# Altium project BCD_TO_7SEG_MODULE.PrjPcb (part 2 of 2)
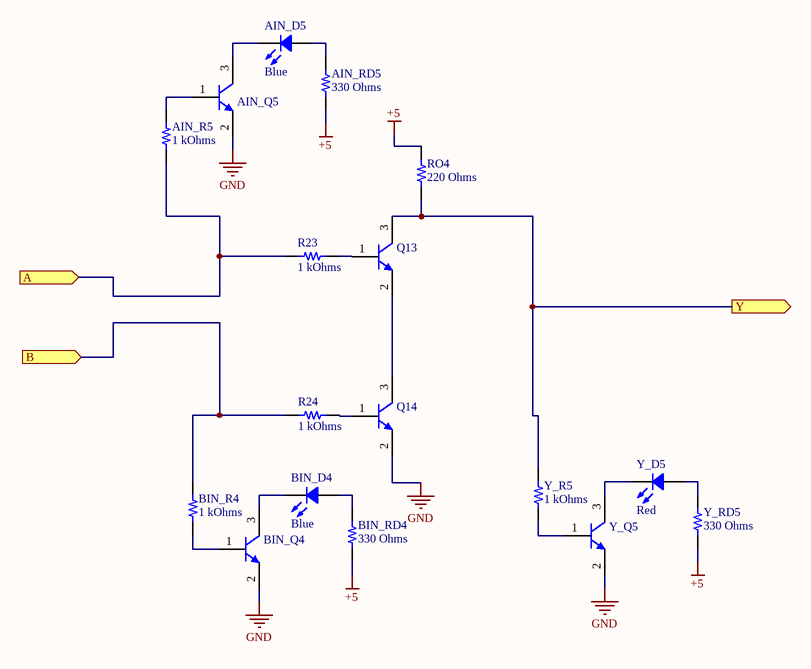
[diagram p6: NAND_GATE.SchDoc]

## Nets that join several sheets
+5: MODULE_1 (IN1.1 IN1.2 OUT1.1), U_XOR_GATE_00 (7 pins), U_NOT_GATE_01 (AIN_RD3_U_NOT_GATE_01.1 RO3_U_NOT_GATE_01.2 Y_RD3_U_NOT_GATE_01.1), U_OR_GATE_22 (5 pins), U_AND_GATE_42 (5 pins), U_NAND_GATE_10 (AIN_RD5_U_NAND_GATE_10.1 BIN_RD4_U_NAND_GATE_10.1 RO4_U_NAND_GATE_10.2 Y_RD5_U_NAND_GATE_10.1), U_XOR_GATE_20 (7 pins), U_XOR_GATE_21 (7 pins), U_OR_GATE_30 (5 pins), U_OR_GATE_31 (5 pins), U_OR_GATE_32 (5 pins), U_NAND_GATE_40 (AIN_RD5_U_NAND_GATE_40.1 BIN_RD4_U_NAND_GATE_40.1 RO4_U_NAND_GATE_40.2 Y_RD5_U_NAND_GATE_40.1), U_OR_GATE_41 (5 pins), U_AND_GATE_43 (5 pins), U_AND_GATE_44 (5 pins), U_AND_GATE_45 (5 pins), U_NOT_GATE_50 (AIN_RD3_U_NOT_GATE_50.1 RO3_U_NOT_GATE_50.2 Y_RD3_U_NOT_GATE_50.1), U_NOT_GATE_51 (AIN_RD3_U_NOT_GATE_51.1 RO3_U_NOT_GATE_51.2 Y_RD3_U_NOT_GATE_51.1), U_NOT_GATE_52 (AIN_RD3_U_NOT_GATE_52.1 RO3_U_NOT_GATE_52.2 Y_RD3_U_NOT_GATE_52.1), U_NOT_GATE_53 (AIN_RD3_U_NOT_GATE_53.1 RO3_U_NOT_GATE_53.2 Y_RD3_U_NOT_GATE_53.1), U_NOT_GATE_54 (AIN_RD3_U_NOT_GATE_54.1 RO3_U_NOT_GATE_54.2 Y_RD3_U_NOT_GATE_54.1), U_NOT_GATE_55 (AIN_RD3_U_NOT_GATE_55.1 RO3_U_NOT_GATE_55.2 Y_RD3_U_NOT_GATE_55.1), U_NOT_GATE_56 (AIN_RD3_U_NOT_GATE_56.1 RO3_U_NOT_GATE_56.2 Y_RD3_U_NOT_GATE_56.1)
GND: MODULE_1 (IN1.8 IN1.9 OUT1.9), U_XOR_GATE_00 (6 pins), U_NOT_GATE_01 (AIN_Q3_U_NOT_GATE_01.2 Q7_U_NOT_GATE_01.2 Y_Q3_U_NOT_GATE_01.2), U_OR_GATE_22 (6 pins), U_AND_GATE_42 (5 pins), U_NAND_GATE_10 (AIN_Q5_U_NAND_GATE_10.2 BIN_Q4_U_NAND_GATE_10.2 Q14_U_NAND_GATE_10.2 Y_Q5_U_NAND_GATE_10.2), U_XOR_GATE_20 (6 pins), U_XOR_GATE_21 (6 pins), U_OR_GATE_30 (6 pins), U_OR_GATE_31 (6 pins), U_OR_GATE_32 (6 pins), U_NAND_GATE_40 (AIN_Q5_U_NAND_GATE_40.2 BIN_Q4_U_NAND_GATE_40.2 Q14_U_NAND_GATE_40.2 Y_Q5_U_NAND_GATE_40.2), U_OR_GATE_41 (6 pins), U_AND_GATE_43 (5 pins), U_AND_GATE_44 (5 pins), U_AND_GATE_45 (5 pins), U_NOT_GATE_50 (AIN_Q3_U_NOT_GATE_50.2 Q7_U_NOT_GATE_50.2 Y_Q3_U_NOT_GATE_50.2), U_NOT_GATE_51 (AIN_Q3_U_NOT_GATE_51.2 Q7_U_NOT_GATE_51.2 Y_Q3_U_NOT_GATE_51.2), U_NOT_GATE_52 (AIN_Q3_U_NOT_GATE_52.2 Q7_U_NOT_GATE_52.2 Y_Q3_U_NOT_GATE_52.2), U_NOT_GATE_53 (AIN_Q3_U_NOT_GATE_53.2 Q7_U_NOT_GATE_53.2 Y_Q3_U_NOT_GATE_53.2), U_NOT_GATE_54 (AIN_Q3_U_NOT_GATE_54.2 Q7_U_NOT_GATE_54.2 Y_Q3_U_NOT_GATE_54.2), U_NOT_GATE_55 (AIN_Q3_U_NOT_GATE_55.2 Q7_U_NOT_GATE_55.2 Y_Q3_U_NOT_GATE_55.2), U_NOT_GATE_56 (AIN_Q3_U_NOT_GATE_56.2 Q7_U_NOT_GATE_56.2 Y_Q3_U_NOT_GATE_56.2)
IN1: MODULE_1 (IN1.7), U_XOR_GATE_20 (BIN_R3_U_XOR_GATE_20.2 R22_U_XOR_GATE_20.1), U_OR_GATE_41 (BIN_R2_U_OR_GATE_41.2 R13_U_OR_GATE_41.1)
IN2: MODULE_1 (IN1.6), U_XOR_GATE_00 (BIN_R3_U_XOR_GATE_00.2 R22_U_XOR_GATE_00.1), U_NOT_GATE_01 (AIN_R3_U_NOT_GATE_01.2 R14_U_NOT_GATE_01.1)
IN3: MODULE_1 (IN1.5), U_OR_GATE_22 (AIN_R2_U_OR_GATE_22.2 R11_U_OR_GATE_22.1), U_NAND_GATE_10 (AIN_R5_U_NAND_GATE_10.2 R23_U_NAND_GATE_10.1), U_XOR_GATE_21 (AIN_R4_U_XOR_GATE_21.2 R21_U_XOR_GATE_21.1), U_OR_GATE_31 (AIN_R2_U_OR_GATE_31.2 R11_U_OR_GATE_31.1), U_NAND_GATE_40 (BIN_R4_U_NAND_GATE_40.2 R24_U_NAND_GATE_40.1)
IN4: MODULE_1 (IN1.4), U_XOR_GATE_00 (AIN_R4_U_XOR_GATE_00.2 R21_U_XOR_GATE_00.1)
NetAIN_R1_U_AND_GATE_42_2: U_AND_GATE_42 (AIN_R1_U_AND_GATE_42.2 R2_U_AND_GATE_42.1), U_OR_GATE_30 (Q5_U_OR_GATE_30.3 RO2_U_OR_GATE_30.1 Y_R2_U_OR_GATE_30.2), U_NOT_GATE_50 (AIN_R3_U_NOT_GATE_50.2 R14_U_NOT_GATE_50.1)
NetAIN_R1_U_AND_GATE_43_2: U_XOR_GATE_20 (Q11_U_XOR_GATE_20.3 R16_U_XOR_GATE_20.1 Y_R4_U_XOR_GATE_20.2), U_OR_GATE_30 (BIN_R2_U_OR_GATE_30.2 R13_U_OR_GATE_30.1), U_OR_GATE_32 (AIN_R2_U_OR_GATE_32.2 R11_U_OR_GATE_32.1), U_NAND_GATE_40 (AIN_R5_U_NAND_GATE_40.2 R23_U_NAND_GATE_40.1), U_AND_GATE_43 (AIN_R1_U_AND_GATE_43.2 R2_U_AND_GATE_43.1)
NetAIN_R1_U_AND_GATE_44_2: U_OR_GATE_31 (Q5_U_OR_GATE_31.3 RO2_U_OR_GATE_31.1 Y_R2_U_OR_GATE_31.2), U_OR_GATE_41 (AIN_R2_U_OR_GATE_41.2 R11_U_OR_GATE_41.1), U_AND_GATE_44 (AIN_R1_U_AND_GATE_44.2 R2_U_AND_GATE_44.1)
NetAIN_R1_U_AND_GATE_45_2: U_AND_GATE_42 (BIN_R1_U_AND_GATE_42.2 R3_U_AND_GATE_42.1), U_OR_GATE_32 (Q5_U_OR_GATE_32.3 RO2_U_OR_GATE_32.1 Y_R2_U_OR_GATE_32.2), U_AND_GATE_44 (BIN_R1_U_AND_GATE_44.2 R3_U_AND_GATE_44.1), U_AND_GATE_45 (AIN_R1_U_AND_GATE_45.2 R2_U_AND_GATE_45.1)
NetAIN_R2_U_OR_GATE_30_2: U_XOR_GATE_00 (Q11_U_XOR_GATE_00.3 R16_U_XOR_GATE_00.1 Y_R4_U_XOR_GATE_00.2), U_OR_GATE_22 (BIN_R2_U_OR_GATE_22.2 R13_U_OR_GATE_22.1), U_XOR_GATE_21 (BIN_R3_U_XOR_GATE_21.2 R22_U_XOR_GATE_21.1), U_OR_GATE_30 (AIN_R2_U_OR_GATE_30.2 R11_U_OR_GATE_30.1)
NetAIN_R3_U_NOT_GATE_51_2: U_NAND_GATE_40 (Q13_U_NAND_GATE_40.3 RO4_U_NAND_GATE_40.1 Y_R5_U_NAND_GATE_40.2), U_NOT_GATE_51 (AIN_R3_U_NOT_GATE_51.2 R14_U_NOT_GATE_51.1)
NetAIN_R3_U_NOT_GATE_52_2: U_OR_GATE_41 (Q5_U_OR_GATE_41.3 RO2_U_OR_GATE_41.1 Y_R2_U_OR_GATE_41.2), U_NOT_GATE_52 (AIN_R3_U_NOT_GATE_52.2 R14_U_NOT_GATE_52.1)
NetAIN_R3_U_NOT_GATE_53_2: U_AND_GATE_42 (Q2_U_AND_GATE_42.3 RO1_U_AND_GATE_42.1 Y_R1_U_AND_GATE_42.2), U_NOT_GATE_53 (AIN_R3_U_NOT_GATE_53.2 R14_U_NOT_GATE_53.1)
NetAIN_R3_U_NOT_GATE_54_2: U_AND_GATE_43 (Q2_U_AND_GATE_43.3 RO1_U_AND_GATE_43.1 Y_R1_U_AND_GATE_43.2), U_NOT_GATE_54 (AIN_R3_U_NOT_GATE_54.2 R14_U_NOT_GATE_54.1)
NetAIN_R3_U_NOT_GATE_55_2: U_AND_GATE_44 (Q2_U_AND_GATE_44.3 RO1_U_AND_GATE_44.1 Y_R1_U_AND_GATE_44.2), U_NOT_GATE_55 (AIN_R3_U_NOT_GATE_55.2 R14_U_NOT_GATE_55.1)
NetAIN_R3_U_NOT_GATE_56_2: U_AND_GATE_45 (Q2_U_AND_GATE_45.3 RO1_U_AND_GATE_45.1 Y_R1_U_AND_GATE_45.2), U_NOT_GATE_56 (AIN_R3_U_NOT_GATE_56.2 R14_U_NOT_GATE_56.1)
NetAIN_R4_U_XOR_GATE_20_2: U_NAND_GATE_10 (Q13_U_NAND_GATE_10.3 RO4_U_NAND_GATE_10.1 Y_R5_U_NAND_GATE_10.2), U_XOR_GATE_20 (AIN_R4_U_XOR_GATE_20.2 R21_U_XOR_GATE_20.1), U_AND_GATE_43 (BIN_R1_U_AND_GATE_43.2 R3_U_AND_GATE_43.1)
NetBIN_R1_U_AND_GATE_45_2: U_OR_GATE_22 (Q5_U_OR_GATE_22.3 RO2_U_OR_GATE_22.1 Y_R2_U_OR_GATE_22.2), U_AND_GATE_45 (BIN_R1_U_AND_GATE_45.2 R3_U_AND_GATE_45.1)
NetBIN_R2_U_OR_GATE_31_2: U_NOT_GATE_01 (Q7_U_NOT_GATE_01.3 RO3_U_NOT_GATE_01.1 Y_R3_U_NOT_GATE_01.2), U_NAND_GATE_10 (BIN_R4_U_NAND_GATE_10.2 R24_U_NAND_GATE_10.1), U_OR_GATE_31 (BIN_R2_U_OR_GATE_31.2 R13_U_OR_GATE_31.1)
NetBIN_R2_U_OR_GATE_32_2: U_XOR_GATE_21 (Q11_U_XOR_GATE_21.3 R16_U_XOR_GATE_21.1 Y_R4_U_XOR_GATE_21.2), U_OR_GATE_32 (BIN_R2_U_OR_GATE_32.2 R13_U_OR_GATE_32.1)
NetQ7_U_NOT_GATE_50_3: MODULE_1 (R4.1), U_NOT_GATE_50 (Q7_U_NOT_GATE_50.3 RO3_U_NOT_GATE_50.1 Y_R3_U_NOT_GATE_50.2)
NetQ7_U_NOT_GATE_51_3: MODULE_1 (R5.1), U_NOT_GATE_51 (Q7_U_NOT_GATE_51.3 RO3_U_NOT_GATE_51.1 Y_R3_U_NOT_GATE_51.2)
NetQ7_U_NOT_GATE_52_3: MODULE_1 (R6.1), U_NOT_GATE_52 (Q7_U_NOT_GATE_52.3 RO3_U_NOT_GATE_52.1 Y_R3_U_NOT_GATE_52.2)
NetQ7_U_NOT_GATE_53_3: MODULE_1 (R7.1), U_NOT_GATE_53 (Q7_U_NOT_GATE_53.3 RO3_U_NOT_GATE_53.1 Y_R3_U_NOT_GATE_53.2)
NetQ7_U_NOT_GATE_54_3: MODULE_1 (R8.1), U_NOT_GATE_54 (Q7_U_NOT_GATE_54.3 RO3_U_NOT_GATE_54.1 Y_R3_U_NOT_GATE_54.2)
NetQ7_U_NOT_GATE_55_3: MODULE_1 (R9.1), U_NOT_GATE_55 (Q7_U_NOT_GATE_55.3 RO3_U_NOT_GATE_55.1 Y_R3_U_NOT_GATE_55.2)
NetQ7_U_NOT_GATE_56_3: MODULE_1 (R10.1), U_NOT_GATE_56 (Q7_U_NOT_GATE_56.3 RO3_U_NOT_GATE_56.1 Y_R3_U_NOT_GATE_56.2)